# EAGLE design OnOnfre_Easy_Light_dev (EAGLE 9.1.3)
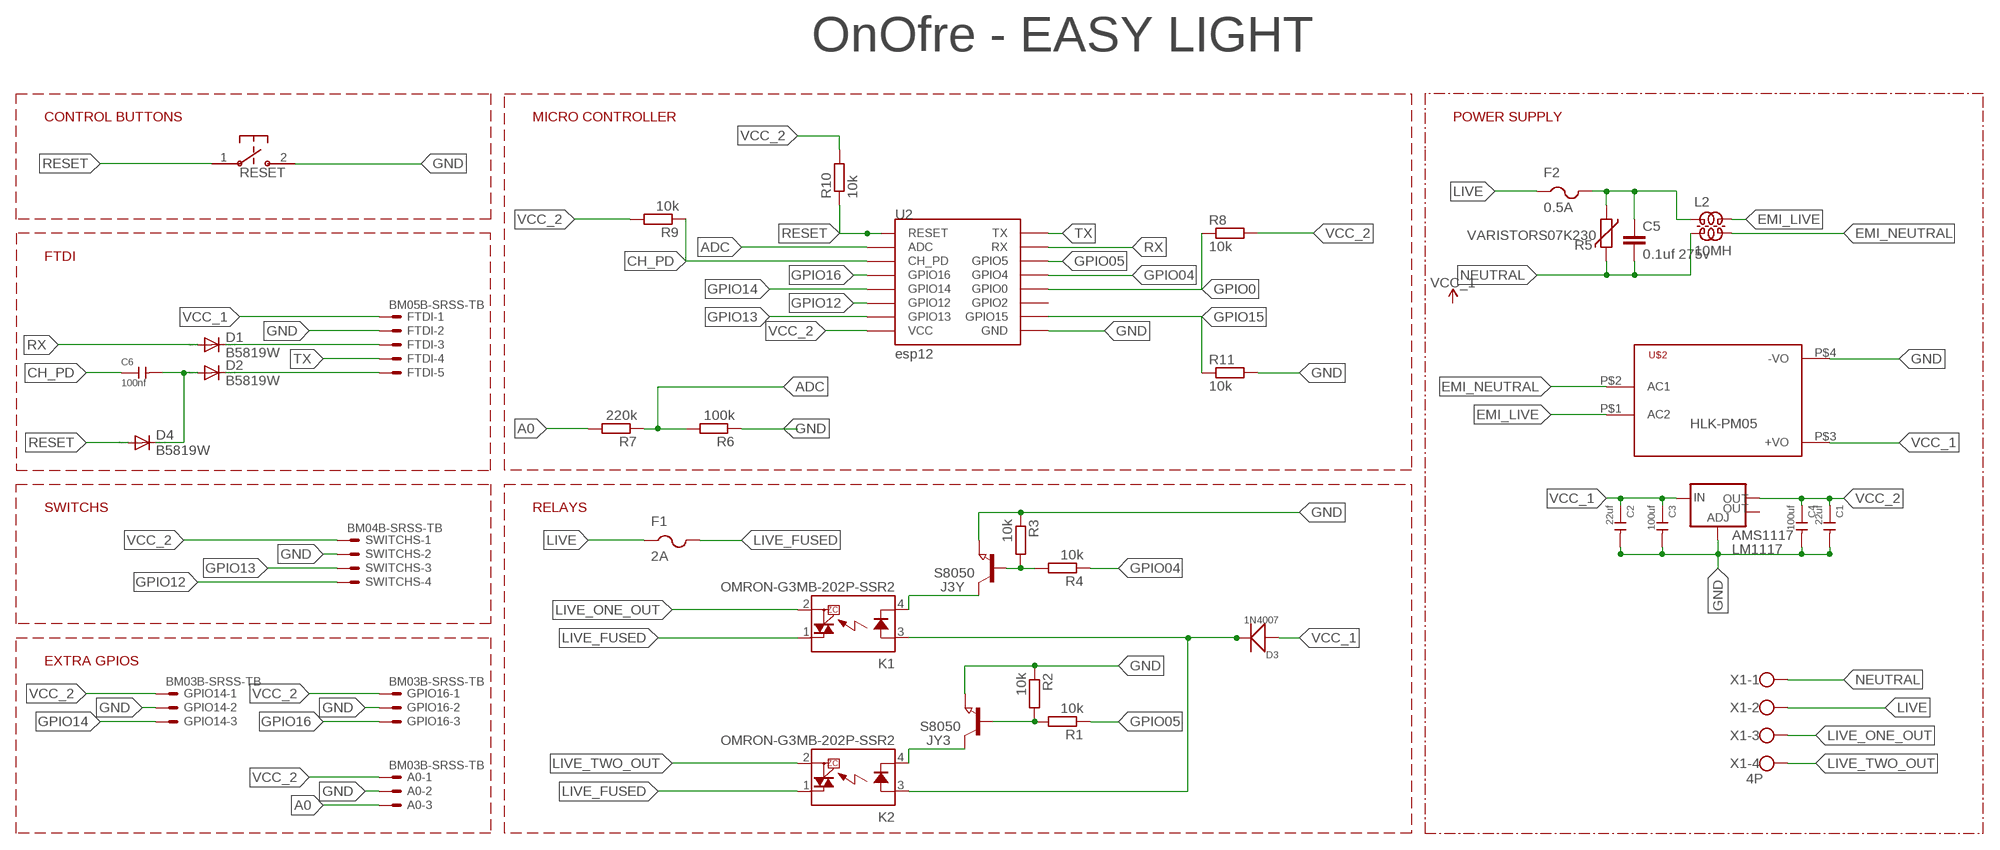
[diagram p0: schematic, sheet 1]

## Parts
A0  BM03B-SRSS-TB  [BM03B-SRSS-TB]
AMS1117  LM1117  V_REG_LM1117SOT223  [SOT223]
C1  22uf  CERAMIC-1NF-1KV-10%-X7R(1206)  [C1206]
C2  22uf  CERAMIC-1NF-1KV-10%-X7R(1206)  [C1206]
C3  100uf  CERAMIC-1NF-1KV-10%-X7R(1206)  [C1206]
C4  100uf  CERAMIC-1NF-1KV-10%-X7R(1206)  [C1206]
C5  0.1uf 275v  C-EU102-054X133  [C102-054X133]
C6  100nf  CERAMIC-100NF-50V-10%-X7R(0603)  [C0603]
D1  B5819W  DIODE-SOD323-R  [SOD323-R]
D2  B5819W  DIODE-SOD323-R  [SOD323-R]
D3  1N4007  DIODE-GEN-PURPOSE-1KV-1A(DO-214AC)  [DO-214AC]
D4  B5819W  DIODE-SOD323-R  [SOD323-R]
F1  2A  PTCFUSE-1812  [1812]
F2  0.5A  PTCFUSE-1812  [1812]
FTDI  BM05B-SRSS-TB  [BM05B-SRSS-TB]
GPIO14  BM03B-SRSS-TB  [BM03B-SRSS-TB]
GPIO16  BM03B-SRSS-TB  [BM03B-SRSS-TB]
J3Y  S8050  NPN-TRANSISTOR_SOT23  [SOT23]
JY3  S8050  NPN-TRANSISTOR_SOT23  [SOT23]
K1  OMRON-G3MB-202P-SSR2  [OMRON-G3MB-202P-SSR]
K2  OMRON-G3MB-202P-SSR2  [OMRON-G3MB-202P-SSR]
L2  10MH  ZD60820510  [ZD6-2X15]
R1  10k  R-EU_R0603  [R0603]
R2  10k  R-EU_R0603  [R0603]
R3  10k  R-EU_R0603  [R0603]
R4  10k  R-EU_R0603  [R0603]
R5  VARISTORS07K230  [S07K230]
R6  100k  R-EU_R0603  [R0603]
R7  220k  R-EU_R0603  [R0603]
R8  10k  R-EU_R0603  [R0603]
R9  10k  R-EU_R0603  [R0603]
R10  10k  R-EU_R0603  [R0603]
R11  10k  R-EU_R0603  [R0603]
RESET  B3U-1000P-2P-SMD  B3U-1000P  [B3U-1000P]
SWITCHS  BM04B-SRSS-TB  [BM04B-SRSS-TB]
U2  esp12  ESP12SMD  [ESP12-SMD]
U$2  HKLPM01  [HKLPM01]
X1  4P  W237-4  [W237-4]

## Nets
5V [VCC_1]: D3.2(-) K1.3(A) K2.3(A)
A0: A0.3 R7.2
ADC: R6.2 R7.1 U2.ADC
CH_PD: C6.1 R9.1 U2.CH_PD
DTR: D2.C FTDI.5
EMI_LIVE [220V]: L2.1 U$2.P$1(AC2)
EMI_NEUTRAL [220V]: L2.2 U$2.P$2(AC1)
GND [GND]: A0.2 AMS1117.1(ADJ) C1.2 C2.2 C3.2 C4.2 FTDI.2 GPIO14.2 GPIO16.2 J3Y.2(E) JY3.2(E) R2.1 R3.1 R6.1 R11.2 RESET.2 SWITCHS.2 U2.GND U$2.P$4(-VO)
GPIO0: R8.1 U2.GPIO0
GPIO04: R4.1 U2.GPIO4
GPIO05: R1.1 U2.GPIO5
GPIO12: SWITCHS.4 U2.GPIO12
GPIO13: SWITCHS.3 U2.GPIO13
GPIO14: GPIO14.3 U2.GPIO14
GPIO15: R11.1 U2.GPIO15
GPIO16: GPIO16.3 U2.GPIO16
LIVE [220V]: F1.1 F2.1 X1.2
LIVE_FUSED: F1.2 K1.1(DS1) K2.1(DS1)
LIVE_ONE_OUT [220V]: K1.2(DS2) X1.3
LIVE_TWO_OUT [220V]: K2.2(DS2) X1.4
N$1: J3Y.3(C) K1.4(K)
N$2 [220V]: C5.1 F2.2 L2.4 R5.2
N$3: D1.C FTDI.3
N$4: C6.2 D2.A D4.C
N$7: J3Y.1(B) R3.2 R4.2
N$9: JY3.3(C) K2.4(K)
N$13: JY3.1(B) R1.2 R2.2
NEUTRAL [220V]: C5.2 L2.3 R5.1 X1.1
RESET: D4.A R10.1 RESET.1 U2.RESET
RX: D1.A U2.RXD0(RX)
TX: FTDI.4 U2.TXD0(TX)
VCC_1 [VCC_1]: AMS1117.3(IN) C2.1 C3.1 D3.1(+) FTDI.1 U$2.P$3(+VO)
VCC_2 [VCC_2]: A0.1 AMS1117.2(OUT) C1.1 C4.1 GPIO14.1 GPIO16.1 R8.2 R9.2 R10.2 SWITCHS.1 U2.VCC
Unconnected: AMS1117.4(OUT) U2.GPIO2

## Notes on the sheet
- OnOfre - EASY LIGHT
- CONTROL BUTTONS | MICRO CONTROLLER | POWER SUPPLY
- FTDI
- HLK-PM05
- SWITCHS | RELAYS
- EXTRA GPIOS

## Library data of the parts
A0 GPIO14 GPIO16 = con-jst2:?M03B-SRSS-TB: Disconnectable Crimp style connector, 1.0mm pitch 3 contacts
AMS1117 = SparkFun-IC-Power:V_REG_LM1117: Voltage Regulator LM1117 Standard adjustable voltage regulator but in SMD form. Spark Fun Electronics SKU : COM-00595; PROD_ID: VREG-08170
C1-C4 = Seeed-Capacitor:CERAMIC-1NF-1KV-10%-X7R?(1206): 302010189; MPN: CC1206KKX7RCBB102; VALUE: 1NF
C5 = rcl:C-EU: CAPACITOR, European symbol; SPICEPREFIX: C
C6 = Seeed-Capacitor:CERAMIC-100NF-50V-10%-X7R(0603): 302010138; MPN: CC0603KRX7R9BB104
D1 D2 D4 = diode:DIODE-: DIODE
D3 = Seeed-Diode:DIODE-GEN-PURPOSE-1KV-1A(DO-214AC): 304010013; MPN: 1N4007
F1 F2 = adafruit:PTCFUSE: PTC fuses, resettable thermistors
FTDI = con-jst2:?M05B-SRSS-TB: Disconnectable Crimp style connector, 1.0mm pitch 5 contacts
J3Y JY3 = semicon-smd-ipc:NPN-TRANSISTOR_: NPN TRANSISTOR
K1 K2 = Omron G3MB 202p SSR:OMRON-G3MB-202P-SSR: IT(rms) 8A, Zero Cross type SIP 4pin Triac output SSR Source: http://sharp-world.com/products/device/lineup/data/pdf/datasheet/s102s02_e.pdf; MPN: S202S02F; OC_FARNELL: 1618475; OC_NEWARK: 14N9588
L2 = inductor-onofre:ZD60820510: WIDE-BAND CHOKE 2 x 1.5 windings
R1-R4 R6-R11 = resistor:R-EU_: RESISTOR, European symbol
R5 = varistor:VARISTOR: VARISTOR
RESET = switches:B3U: Switch; DIGIKEY: SW1020CT-ND; MANUFACTURER: Omron; MPN: B3U-1000P
SWITCHS = con-jst2:?M04B-SRSS-TB: Disconnectable Crimp style connector, 1.0mm pitch 4 contacts
U2 = esp8266modules:ESP12: ESP8266 Wifi module 12
U$2 = HKLPM01:HKLPM01
X1 = con-wago-500:W237-4: WAGO SCREW CLAMP; OC_FARNELL: unknown; OC_NEWARK: unknown

## Net classes
1 220V: width 1.143 mm, clearance 1.8 mm
2 GND: width 0.254 mm
3 VCC_1: width 0.254 mm
4 VCC_2: width 0.254 mm

## Board
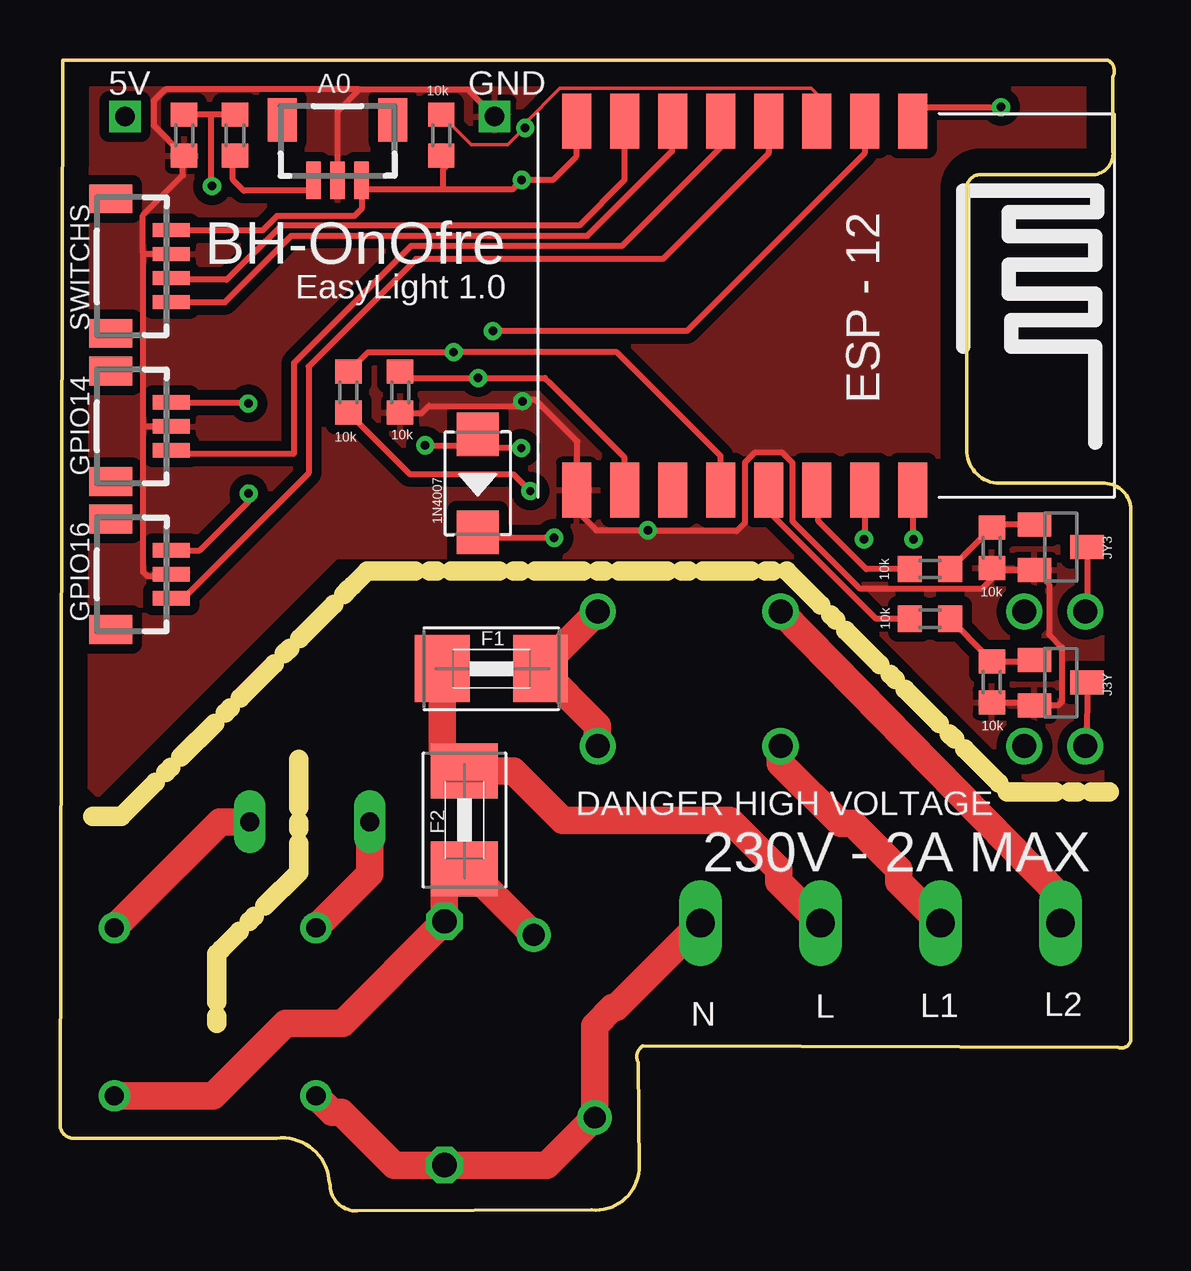
[diagram p1: board, top side]
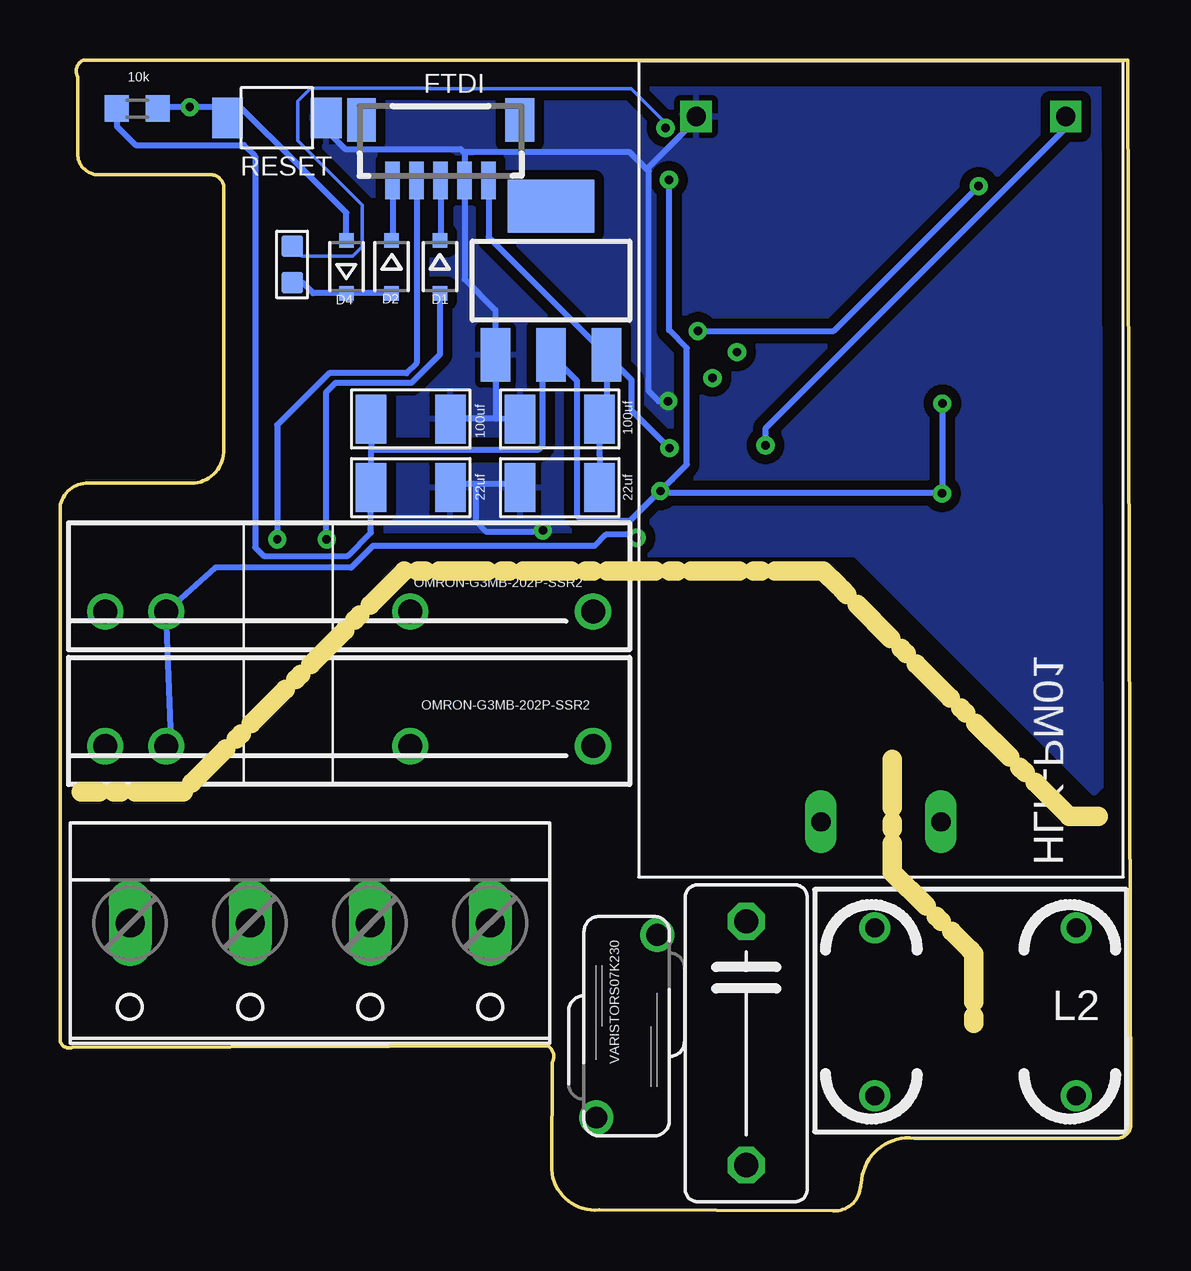
[diagram p2: board, bottom side, seen from below]

Size 44.61 x 47.97 mm. Coordinates in mm from the lower left corner, seen from the top.
Outline: 0.12,47.97 0,3.57 arc90 0.59,3.02 9.03,3.02 arc-90 11.21,1.32 11.25,1.04 arc90 12.39,0 22.15,0.03 arc90 24.13,1.7 24.1,6.18 arc-90 24.29,6.87 44.1,6.81 arc90 44.61,7.07 44.61,29.33 arc90 43.32,30.32 39.13,30.32 arc-90 37.78,31.73 37.78,42.69 arc-90 38.43,43.19 43.07,43.19 arc90 43.87,44.14 43.87,47.26 arc90 43.65,47.97 0.12,47.97
Copper layers (1*16): Top 0.035mm / dielectric 1.5mm / Bottom 0.035mm
Design rules "default": minimum track width 6mil, minimum drill 0.35mm, track to track 6mil, track to pad 6mil, pad to pad 6mil, via to via 6mil, smd to smd 6mil, copper to edge 40mil, drill to drill 6mil, minimum pad ring 10mil, minimum via ring 8mil, stop-mask expansion 4mil, vias tented up to drill 0mil, thermal gap 10mil
Milling: 39 lines

### Footprints (pad centres in the part's own frame; a part is rotated, then mirrored left to right if it is on the bottom)
BM03B-SRSS-TB = smd 0.6 x 1.55: 1 1,-1.625; 2 0,-1.625; 3 -1,-1.625 | smd 1.2 x 1.8: FIT@1 2.3,0.9; FIT@2 -2.3,0.9
SOT223 = smd 1.219 x 2.235: 1 -2.311,-3.099; 2 0,-3.099; 3 2.311,-3.099 | smd 3.6 x 2.2: 4 0,3.099
C1206 = smd 1.27 x 2.032: 1 -1.651,0; 2 1.651,0
C102-054X133 = drill 1.016 octagon: 1 -5.08,0; 2 5.08,0
C0603 = smd 0.889 x 0.889: 1 0,0.762; 2 0,-0.762
SOD323-R = smd 0.6 x 0.6: A 1.1,0; C -1.1,0
DO-214AC = smd 1.8 x 1.77: 1 -2.042,0; 2 2.042,0
1812 = smd 2.286 x 2.794: 1 -2.046,0; 2 2.046,0
BM05B-SRSS-TB = smd 0.6 x 1.55: 1 2,-1.625; 2 1,-1.625; 3 0,-1.625; 4 -1,-1.625; 5 -2,-1.625 | smd 1.2 x 1.8: FIT@1 3.3,0.9; FIT@2 -3.3,0.9
SOT23 = smd 1 x 1.4: 1 -0.95,-1.1; 2 0.95,-1.1; 3 0,1.1
OMRON-G3MB-202P-SSR = drill 1: 1 -12.7,0; 2 -5.08,0; 3 5.08,0; 4 7.62,0
ZD6-2X15 = drill 0.8: 1 1.5,10.9; 2 1.5,2.5; 3 8.5,2.5; 4 8.5,10.9
R0603 = smd 1 x 1.1: 1 -0.85,0; 2 0.85,0
S07K230 = drill 0.914: 1 -1.27,-3.81; 2 1.27,3.81
B3U-1000P = smd 1.283 x 1.7: 1 -2.056,0; 2 2.056,0
BM04B-SRSS-TB = smd 0.6 x 1.55: 1 1.5,-1.625; 2 0.5,-1.625; 3 -0.5,-1.625; 4 -1.5,-1.625 | smd 1.2 x 1.8: FIT@1 2.8,0.9; FIT@2 -2.8,0.9
ESP12-SMD = smd 2.286 x 1.2: ADC -7.792,3.8; CH_PD -7.792,1.8; GND 7.592,-8.2; GPIO0 7.592,-2.2; GPIO2 7.592,-4.2; GPIO4 7.592,-0.2; GPIO5 7.592,1.8; GPIO12 -7.792,-4.2; GPIO13 -7.792,-6.2; GPIO14 -7.792,-2.2; GPIO15 7.592,-6.2; GPIO16 -7.792,-0.2; RESET -7.792,5.8; RXD0 7.592,3.8; TXD0 7.592,5.8; VCC -7.792,-8.2
HKLPM01 = drill 0.8 long: P$1 -14.7,2.5; P$2 -14.7,-2.5 | drill 0.8 square: P$3 14.7,7.7; P$4 14.7,-7.7
W237-4 = drill 1.194 long: 1 -7.5,-1.27; 2 -2.5,-1.27; 3 2.5,-1.27; 4 7.5,-1.27

### Placement (x,y rotation side)
A0  11.57,44.57 0 top
AMS1117  24.15,38.77 0 bottom
C1  29.99,30.14 0 bottom
C2  23.78,30.14 180 bottom
C3  23.78,33 180 bottom
C4  29.99,33 0 bottom
C5  16.02,6.98 270 bottom
C6  34.94,39.44 0 bottom
D1  28.78,39.34 270 bottom
D2  30.8,39.34 270 bottom
D3  17.41,30.32 270 top
D4  32.68,39.34 90 bottom
F1  17.98,22.6 0 top
F2  16.85,16.29 270 top
FTDI  28.75,44.57 0 bottom
GPIO14  3.01,32.7 90 top
GPIO16  3.01,26.53 90 top
J3Y  41.7,22.02 270 top
JY3  41.7,27.66 270 top
K1  35.1,19.37 180 bottom
K2  35.1,24.98 180 bottom
L2  13.17,13.29 270 bottom
R1  36.25,26.75 0 top
R2  38.83,27.64 90 top
R3  38.83,22.05 90 top
R4  36.25,24.68 0 top
R5  21,7.7 0 bottom
R6  5.17,44.83 90 top
R7  7.29,44.83 270 top
R8  12.01,34.12 270 top
R9  15.89,44.83 270 top
R10  41.39,45.94 180 bottom
R11  14.17,34.12 270 top
RESET  35.57,45.56 0 bottom
SWITCHS  3.01,39.37 90 top
U2  29.73,37.63 270 top
U$2  10.41,30.91 90 top
X1  34.19,10.71 180 bottom

### Tracks (layer width: path | path; a pad name or v marks a point on that pad's centre or on a via)
5V  (via drill 0.35)
  Top 0.254: v20.59,28.05 20.23,28.05 20.22,28.07 17.62,28.07 D3.2
  Bottom 0.254: K1.3 39.98,19.56 K2.3 38.15,26.81 32.48,26.81 31.58,27.71 22.34,27.71 21.87,28.18 20.72,28.18 v20.59,28.05
A0
  Top 0.254: A0.3 10.54,42.52 7.67,42.52 7.21,42.98 7.21,44.05 7.23,44.05 R7.2
ADC  (via drill 0.35)
  Top 0.254: v18.03,36.67 26.12,36.67 33.53,44.08 U2.ADC | R7.1 6.3,45.68 | 6.3,45.68 R6.2 | R6.2 | v6.33,42.71 6.3,42.74 6.3,45.68
  Bottom 0.254: v18.03,36.67 12.37,36.67 v6.33,42.71
CH_PD  (via drill 0.35)
  Top 0.152: U2.CH_PD 31.53,46.57 31.3,46.79 20.92,46.79 20.83,46.79 19.38,45.34 v19.38,45.14 19.35,45.14 18.66,44.44 17.13,44.44 R9.1
  Bottom 0.152: v19.38,45.14 19.38,45.33 20.82,46.77 20.81,46.78 29.18,46.78 34.17,46.78 34.7,46.25 34.7,44.6 32.01,41.91 32.01,40.19 32.41,39.79 34.53,39.79 C6.1
DTR
  Bottom 0.254: FTDI.5 30.75,40.55 D2.C
EMI_LIVE
  Top 1.143: L2.1 6.68,16.21 U$2.P$1
EMI_NEUTRAL
  Top 1.143: L2.2 12.91,14.04 U$2.P$2
GND  (via drill 0.35)
  Top 0.254: R2.1 38.94,26.68 40.56,26.68 JY3.2 | R3.1 40.45,21.2 J3Y.2 41.59,21.07 41.75,21.23 41.75,23.49 41.21,24.02 41.21,26.1 JY3.2 | 19.33,33.8 19.83,33.8 21.56,32.07 21.56,30.11 21.53,30.07 U2.GND 21.62,29.94 21.62,29.08 21.65,29.06 21.69,29.01 22.34,28.37 v24.49,28.37 24.53,28.33 28.2,28.33 28.54,28.67 28.54,31.19 28.95,31.6 30.1,31.6 30.53,31.17 30.53,28.73 33.34,25.92 38.41,25.92 39.21,26.71 JY3.2 | 19.33,33.8 v19.27,33.75 | R11.2 15.05,33.23 15.37,33.54 19.07,33.54 19.33,33.8 | A0.2 11.57,45.84 12.48,46.75 | 12.48,46.75 16.97,46.75 U$2.P$4 | 5.12,44.03 R6.1 | 12.48,46.75 4.39,46.75 3.9,46.26 3.9,45.25 5.12,44.03 | 3.45,39.96 3.45,41.49 5.12,43.16 5.12,44.03 | 3.45,39.96 3.45,39.81 3.45,32.67 | 3.45,32.67 3.45,32.49 3.45,26.64 3.65,26.44 4.54,26.44 GPIO16.2 | GPIO14.2 3.48,32.7 3.45,32.67 | SWITCHS.2 3.54,39.87 3.45,39.96
  Bottom 0.254: C3.2 26.44,33.02 | 26.44,33.02 28.33,33.02 C4.2 | C2.2 25.58,30.29 26.46,30.29 27.27,30.29 | 26.44,33.02 26.46,33.04 AMS1117.1 26.47,37.55 27.75,38.83 FTDI.2 27.74,42.96 27.74,44.08 27.8,44.14 | 27.27,30.29 27.27,30.22 27.27,30.2 27.27,28.73 26.84,28.3 24.56,28.3 v24.49,28.37 | 20.08,43.33 20.08,34.16 19.67,33.75 v19.27,33.75 | 20.08,43.33 20.08,43.51 18.11,45.48 U$2.P$4 | 27.8,44.14 27.92,44.26 32.73,44.26 33.52,45.05 RESET.2 | 27.8,44.14 20.9,44.14 20.08,43.33 | C1.2 28.21,30.29 27.35,30.29 27.27,30.29
  pour Bottom (isolate 0.406): 0.41,47.83 0.41,18.52 1.52,17.41 11.46,27.35 30.92,27.35 40.16,18.11 44.13,18.11 44.13,29.67 44.19,29.73 38.09,29.73 37.46,30.36 37.2,30.62 37.2,43.57 37.46,43.83 43.43,43.83 43.43,47.7 43.36,47.76 0.53,47.76 0.47,47.83 0.47,47.7
  pour Top (isolate 0.406): 0.47,47.76 0.47,18.46 1.58,17.35 11.52,27.28 30.98,27.28 40.22,18.04 44.19,18.04 44.19,29.6 44.25,29.67 38.16,29.67 37.52,30.3 37.27,30.55 37.27,43.51 37.52,43.76 43.49,43.76 43.49,47.64 43.43,47.7 0.6,47.7 0.53,47.76 0.53,47.64
GPIO0  (via drill 0.35)
  Top 0.254: 16.68,35.79 23.2,35.79 27.53,31.47 U2.GPIO0 | 16.68,35.79 v16.4,35.79 | R8.1 12.84,35.79 16.68,35.79
GPIO04
  Top 0.254: U2.GPIO4 29.54,30.02 29.54,29.15 34.01,24.68 R4.1
GPIO05
  Top 0.254: R1.1 33.6,26.75 31.6,28.75 31.6,29.5 31.53,29.58 U2.GPIO5
GPIO12
  Top 0.254: U2.GPIO12 25.5,45.4 25.5,44.16 21.97,40.64 9.63,40.64 6.87,37.87 SWITCHS.4
GPIO13
  Top 0.254: U2.GPIO13 23.52,42.96 21.63,41.07 9.21,41.07 6.94,38.8 4.71,38.8 SWITCHS.3
GPIO14
  Top 0.152: 27.26,44.06 27.53,44.33 U2.GPIO14
  Top 0.254: 27.53,44.33 27.26,44.06 23.42,40.22 14.63,40.22 9.76,35.35 9.76,31.57 4.8,31.57 GPIO14.3
GPIO15  (via drill 0.35)
  Top 0.254: U2.GPIO15 23.53,31.4 20.4,34.52 20.21,34.72 17.5,34.72 | v17.42,34.72 17.5,34.72 | 17.5,34.72 14.39,34.72 R11.1
GPIO16
  Top 0.254: U2.GPIO16 29.53,44.13 29.55,44.11 25.11,39.67 14.84,39.67 10.36,35.19 10.36,30.76 5.13,25.53 GPIO16.3
LIVE
  Top 1.143: X1.2 29.95,13.72 29.95,14.23 27.91,16.27 20.94,16.27 18.88,18.33 F2.1 15.93,19.26 F1.1
LIVE_FUSED
  Top 1.143: K2.1 22.2,24.77 F1.2 22.39,20.22 K1.1
LIVE_ONE_OUT
  Top 1.143: K1.2 30.01,18.66 32.52,16.15 33.04,16.15 34.95,14.23 34.95,13.72 X1.3
LIVE_TWO_OUT
  Top 1.143: K2.2 41.68,13.11 X1.4
N$1
  Top 0.254: J3Y.3 42.78,19.43 K1.4
N$2
  Top 1.143: R5.2 17,14.24 F2.2 16.02,13.41 C5.1 11.78,7.82 9.41,7.82 6.39,4.79 L2.4
N$3
  Bottom 0.254: FTDI.3 28.75,40.48 D1.C
N$4
  Bottom 0.254: D2.A 32.56,38.24 32.62,38.3 D4.C 34.06,38.24 34.49,38.68 C6.2
N$7
  Top 0.254: R4.2 38.59,23.14 R3.2 40.51,22.9 J3Y.1
N$9
  Top 0.254: JY3.3 42.8,25.26 K2.4
N$13
  Top 0.254: JY3.1 39.63,28.61 38.95,28.61 R2.2 R1.2
NEUTRAL
  Top 1.143: X1.1 23.17,8.47 23.03,8.47 22.27,7.71 R5.1 20.29,1.9 C5.2 14.76,1.9 | 14.76,1.9 13.93,1.9 | L2.3 11.35,4.11 11.72,4.11 13.93,1.9 | 13.93,1.9 14.76,1.9
RESET  (via drill 0.35)
  Top 0.254: U2.RESET 36.11,46 v39.21,46
  Bottom 0.254: R10.1 40.48,46 v39.21,46 38.08,46 RESET.1 37.63,46 37.1,46 35.91,44.82 35.91,44.83 32.68,41.6 D4.A
RX  (via drill 0.35)
  Top 0.254: U2.RXD0 33.53,28.01 v33.5,27.99
  Bottom 0.254: D1.A 28.78,35.69 29.97,34.51 33.13,34.51 33.53,34.11 33.53,28.02 v33.5,27.99
TX  (via drill 0.35)
  Top 0.254: v35.56,27.99 35.56,30 U2.TXD0
  Bottom 0.254: FTDI.4 29.75,35.34 30.18,34.91 33.4,34.91 35.56,32.75 v35.56,27.99
VCC_1  (via drill 0.35)
  Top 0.254: v19.22,31.79 17.55,31.79 17.41,31.94 D3.1 16.95,31.91 v15.21,31.91
  Bottom 0.254: C2.1 22.23,30.05 22.23,29.77 22.11,29.89 C3.1 21.84,33.29 AMS1117.3 | FTDI.1 26.75,40.59 AMS1117.3 | AMS1117.3 20.81,34.64 20.81,33.38 19.86,32.44 | 19.86,32.44 | 19.86,32.44 v19.22,31.79 | v15.21,31.91 15.21,32.62 2.71,45.13 | U$2.P$3 2.71,45.42 | 2.71,45.42 2.71,45.13 | 2.71,45.13 2.71,45.42
VCC_2  (via drill 0.35)
  Top 0.254: U2.VCC 21.51,45.4 21.51,43.95 20.53,42.97 v19.24,42.97 18.84,42.57 16.04,42.57 | R8.2 14.58,30.7 18.89,30.7 v19.6,30 | R9.2 16.1,43.55 15.98,43.43 15.98,42.63 16.04,42.57 | SWITCHS.1 8.44,40.87 9.04,41.48 12.27,41.48 12.59,41.8 12.59,42.52 | 12.59,42.52 A0.1 | GPIO14.1 7.8,33.7 v7.85,33.65 | GPIO16.1 5.82,27.53 7.86,29.57 v7.86,29.9 | 16.04,42.57 12.64,42.57 12.59,42.52
  Bottom 0.254: v19.24,42.97 19.24,36.7 18.49,35.96 18.49,31.11 19.1,30.5 19.1,30.49 v19.6,30 | R10.2 42.24,45.21 41.46,44.42 36.95,44.42 36.48,43.96 36.48,27.65 36.13,27.3 32.63,27.3 31.66,28.27 C1.1 31.65,31.72 | v19.6,30 19.6,30.03 20.85,28.78 22.88,28.78 23.08,28.98 23.08,34.6 AMS1117.2 24.52,35.3 24.52,31.87 24.68,31.71 31.63,31.71 31.65,31.72 | v7.85,33.65 7.85,29.92 7.88,29.92 | 7.88,29.92 v7.86,29.9 | 7.88,29.92 19.51,29.92 v19.6,30 | C4.1 31.65,31.72

### Text on the board
tNames: 5V | GND | BH-OnOfre | EasyLight 1.0 | DANGER HIGH VOLTAGE | 230V - 2A MAX | L1 | L | L2 | N